# Altium schematic sheet 08 Camera.SchDoc
size 177 x 152 mm
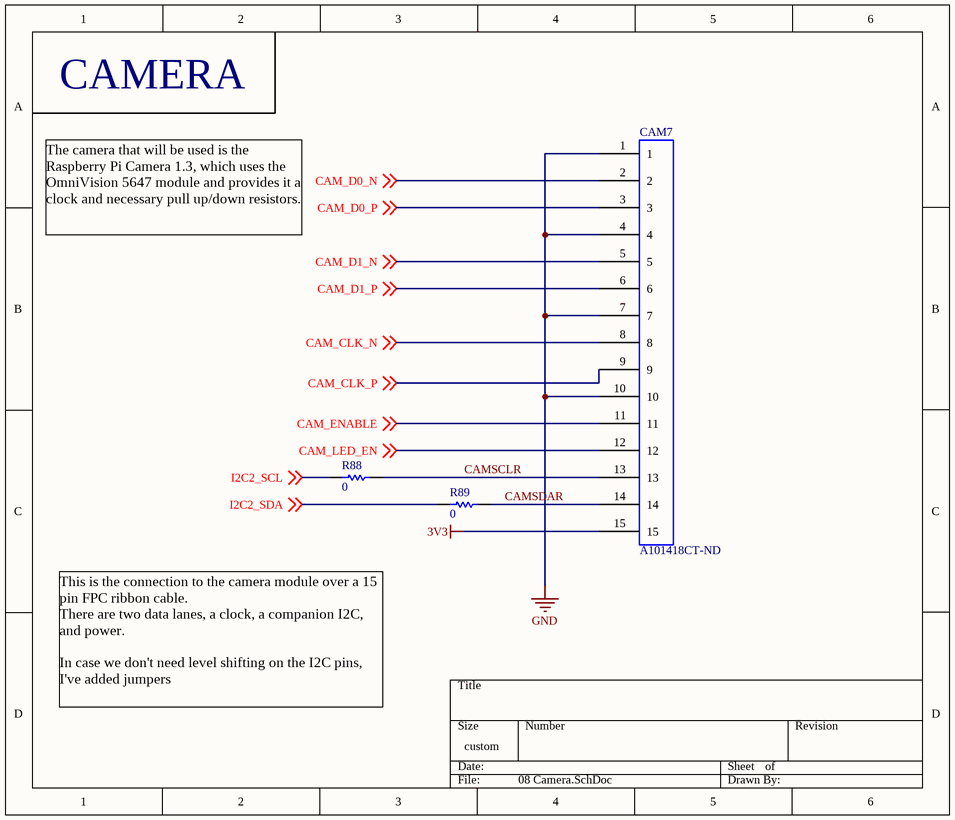
[diagram p0: 08 Camera.SchDoc]

## Parts
CAM7  A101418CT-ND  [ZIF_15pin]
R88  RES_0805_JMP  [RES0805]  (value not drawn)
R89  RES_0805_JMP  [RES0805]  (value not drawn)

## Nets
3V3: CAM7.15
GND: CAM7.1 CAM7.4 CAM7.7 CAM7.10
CAM_CLK_N: CAM7.8 ; off-sheet CAM_CLK_N
CAM_CLK_P: CAM7.9 ; off-sheet CAM_CLK_P
CAM_D0_N: CAM7.2 ; off-sheet CAM_D0_N
CAM_D0_P: CAM7.3 ; off-sheet CAM_D0_P
CAM_D1_N: CAM7.5 ; off-sheet CAM_D1_N
CAM_D1_P: CAM7.6 ; off-sheet CAM_D1_P
CAM_ENABLE: CAM7.11 ; off-sheet CAM_ENABLE
CAM_LED_EN: CAM7.12 ; off-sheet CAM_LED_EN
CAMSCLR: CAM7.13 R88.2
CAMSDAR: CAM7.14 R89.2
I2C2_SCL: R88.1 ; off-sheet I2C2_SCL
I2C2_SDA: R89.1 ; off-sheet I2C2_SDA

## Notes on the sheet
- CAMERA
- The camera that will be used is the Raspberry Pi Camera 1.3, which uses the OmniVision 5647 module and provides it a clock and necessary pull up/down resistors.
- This is the connection to the camera module over a 15 pin FPC ribbon cable.
  There are two data lanes, a clock, a companion I2C, and power.
  In case we don't need level shifting on the I2C pins, I've added jumpers
- (in symbol RES_0805_JMP) 0

## Library data of the parts
CAM7 = A101418CT-ND: CONN FPC VERT 15POS 1.00MM SMD; Manufacturer: TE Connectivity; Manufacturer Part Number: 1-1734248-5; Current Rating: 1A; Voltage Rating: 125V; Gender: Receptacle; Number of Positions: 15; Shielding: Unshielded; Connector Type: Connector,Receptacle,Socket; Wire/Cable Type: Flat Flex; Connector System: Flex-to-Board; Mating Alignment: Yes (With); PCB Mount Alignment: No (Without); PCB Mount Retention: With; PCB Mounting Orientation: Vertical; Pitch: 0.039inch; Supplier 1: Digi-Key; Stock 1: 14321; Pricing 1: 1=1.67, 10=1.515, 25=1.4224, 50=1.3606, 100=1.2988, 250=1.1751, 500=1.0824 (USD); Mount: Surface Mount; Case/Package: SMD/SMT; Contact Plating: Gold; Contact Material: Bronze; Housing Colour: Black; Housing Material: Thermoplastic; Min Operating Temperature: -4°C; Max Operating Temperature: 185°C; Package Quantity: 1000; Packaging: Tape and Reel; Number of Rows: 1; Termination: SMD/SMT; Number of Contacts: 15; Orientation: Straight; Max Current Rating: 1A; Sealable: No (Without); Shrouded: Yes (With); Length: 22.4mm; Height: 7.7mm; Width: 4.6mm; Depth: 4.6mm; REACH SVHC: Unknown; ELV: Compliant; Flammability Rating: UL94 V-0; ComponentLink1URL: https://datasheet.ciiva.com/672/eng-cd-1734248-e1-672176.pdf; ComponentLink1Description: https://datasheet.ciiva.com/672/eng-cd-1734248-e1-672176.pdf; ComponentLink2URL: https://datasheet.ciiva.com/672/eng-cd-1734248-e1-672177.pdf; ComponentLink2Description: https://datasheet.ciiva.com/672/eng-cd-1734248-e1-672177.pdf; ComponentLink3URL: https://datasheet.ciiva.com/672/eng-cd-1734248-e1-672178.pdf; ComponentLink3Description: https://datasheet.ciiva.com/672/eng-cd-1734248-e1-672178.pdf; ComponentLink4URL: https://datasheet.ciiva.com/7989/eng-ds-1-1773440-6-0506-7989477.pdf; ComponentLink4Description: https://datasheet.ciiva.com/7989/eng-ds-1-1773440-6-0506-7989477.pdf; ComponentLink5URL: https://datasheet.ciiva.com/16660/eng-ds-1-1773440-6-0506-16660185.pdf; ComponentLink5Description: https://datasheet.ciiva.com/16660/eng-ds-1-1773440-6-0506-16660185.pdf; Supplier Part Number 1: A101418CT-ND
R88 R89 = RES_0805_JMP: RES, THICK FILM, 0R, 0.125W, 0805; Manufacturer: Yageo; Manufacturer Part Number: RC0805JR-070RL; Resistance: 0mR; Tolerance: 5%; Voltage Rating: 150V; Power Rating: 125mW; Temperature Coefficient: 200ppm/°C; Supplier 1: Digi-Key; Supplier Part Number 1: 311-0.0ARCT-ND; Stock 1: 6469744; Pricing 1: 1=0.1, 10=0.018, 25=0.0128, 50=0.0096, 100=0.0071, 250=0.0054, 500=0.0044, 1000=0.0032 (USD); Case/Package: 0805; Number of Pins: 2; Case Code (Imperial): 0805; Case Code (Metric): 2012; Contact Plating: Tin,Matte; Min Operating Temperature: -55°C; Max Operating Temperature: 155°C; Packaging: Tape and Reel; Voltage Rating (DC): 150V; Termination: SMD/SMT; Composition: Thick Film; Military Standard: Not; Length: 2mm; Height: 0.5mm; Width: 1.25mm; Depth: 1.25mm; Radiation Hardening: No; REACH SVHC: Unknown; Lead Free: Lead Free; ComponentLink1URL: https://datasheet.ciiva.com/7941/1738694-7941861.pdf; ComponentLink1Description: https://datasheet.ciiva.com/7941/1738694-7941861.pdf; ComponentLink2URL: https://datasheet.ciiva.com/7941/1738694-7941862.pdf; ComponentLink2Description: https://datasheet.ciiva.com/7941/1738694-7941862.pdf; ComponentLink3URL: https://datasheet.ciiva.com/11819/0900766b8106beab-11819430.pdf; ComponentLink3Description: https://datasheet.ciiva.com/11819/0900766b8106beab-11819430.pdf; ComponentLink4URL: https://datasheet.ciiva.com/7941/1738694-7941863.pdf; ComponentLink4Description: https://datasheet.ciiva.com/7941/1738694-7941863.pdf; ComponentLink5URL: https://datasheet.ciiva.com/15190/getdatasheetpartid-330685-15190028.pdf; ComponentLink5Description: https://datasheet.ciiva.com/15190/getdatasheetpartid-330685-15190028.pdf